# EAGLE design schema (EAGLE 7.3.0)
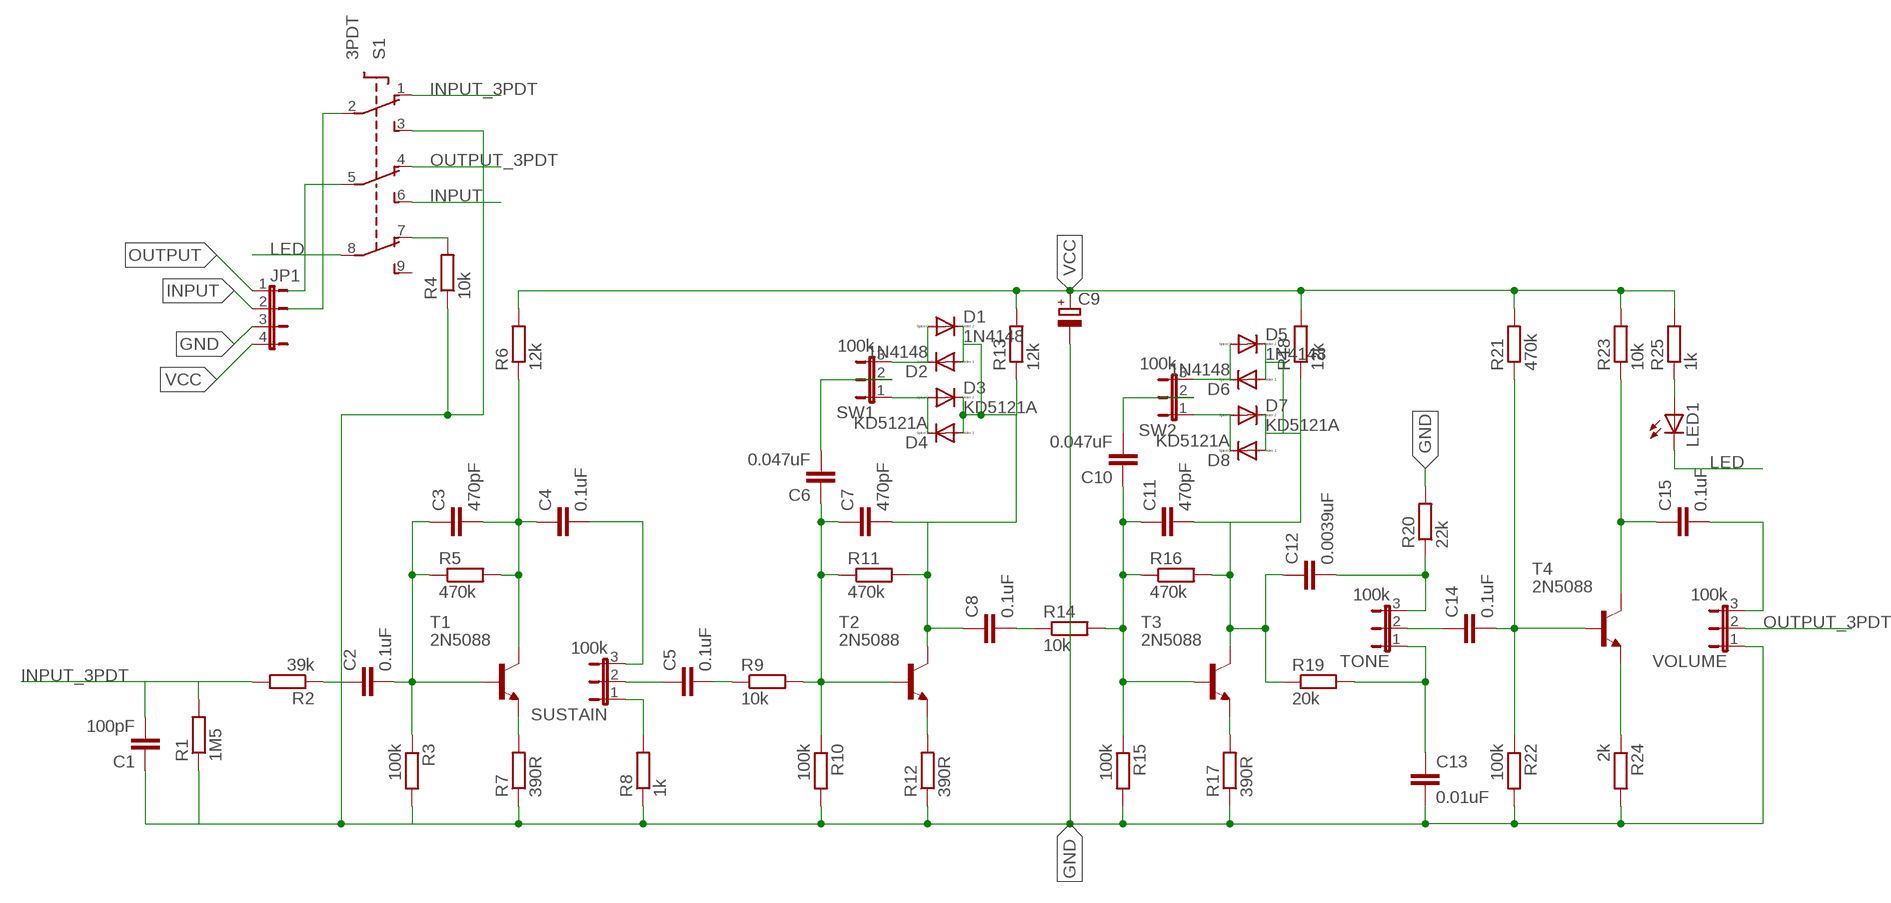
[diagram p0: schematic, sheet 1]

## Parts
C1  100pF  C-EU025-025X050  [C025-025X050]
C2  0.1uF  C-EU075-042X103  [C075-042X103]
C3  470pF  C-EU025-025X050  [C025-025X050]
C4  0.1uF  C-EU075-042X103  [C075-042X103]
C5  0.1uF  C-EU075-042X103  [C075-042X103]
C6  0.047uF  C-EU102-043X133  [C102-043X133]
C7  470pF  C-EU025-025X050  [C025-025X050]
C8  0.1uF  C-EU075-042X103  [C075-042X103]
C9  CPOL-EUE2.5-6  [E2,5-6]
C10  0.047uF  C-EU102-043X133  [C102-043X133]
C11  470pF  C-EU025-025X050  [C025-025X050]
C12  0.0039uF  C-EU050-045X075  [C050-045X075]
C13  0.01uF  C-EU075-042X103  [C075-042X103]
C14  0.1uF  C-EU075-042X103  [C075-042X103]
C15  0.1uF  C-EU075-042X103  [C075-042X103]
D1  1N4148  1N4148DO35-10  [DO35-10]
D2  1N4148  1N4148DO35-10  [DO35-10]
D3  KD5121A  1N4148DO35-10  [DO35-10]
D4  KD5121A  1N4148DO35-10  [DO35-10]
D5  1N4148  1N4148DO35-10  [DO35-10]
D6  1N4148  1N4148DO35-10  [DO35-10]
D7  KD5121A  1N4148DO35-10  [DO35-10]
D8  KD5121A  1N4148DO35-10  [DO35-10]
JP1  JP4E  [JP4]
LED1  LEDB155  [Q62902-B155]
R1  1M5  R-EU_0204/2V  [0204V]
R2  39k  R-EU_0204/2V  [0204V]
R3  100k  R-EU_0204/2V  [0204V]
R4  10k  R-EU_0204/2V  [0204V]
R5  470k  R-EU_0204/2V  [0204V]
R6  12k  R-EU_0204/2V  [0204V]
R7  390R  R-EU_0204/2V  [0204V]
R8  1k  R-EU_0204/2V  [0204V]
R9  10k  R-EU_0204/2V  [0204V]
R10  100k  R-EU_0204/2V  [0204V]
R11  470k  R-EU_0204/2V  [0204V]
R12  390R  R-EU_0204/2V  [0204V]
R13  12k  R-EU_0204/2V  [0204V]
R14  10k  R-EU_0204/2V  [0204V]
R15  100k  R-EU_0204/2V  [0204V]
R16  470k  R-EU_0204/2V  [0204V]
R17  390R  R-EU_0204/2V  [0204V]
R18  12k  R-EU_0204/2V  [0204V]
R19  20k  R-EU_0204/2V  [0204V]
R20  22k  R-EU_0204/2V  [0204V]
R21  470k  R-EU_0204/2V  [0204V]
R22  100k  R-EU_0204/2V  [0204V]
R23  10k  R-EU_0204/2V  [0204V]
R24  2k  R-EU_0204/2V  [0204V]
R25  1k  R-EU_0204/2V  [0204V]
S1  3PDT  [3PDT]
SUSTAIN  100k  JP2E  [JP2]
SW1  100k  JP2E  [JP2]
SW2  100k  JP2E  [JP2]
T1  2N5088  [TO92]
T2  2N5088  [TO92]
T3  2N5088  [TO92]
T4  2N5088  [TO92]
TONE  100k  JP2E  [JP2]
VOLUME  100k  JP2E  [JP2]

## Nets
GND: C1.1 C9.- C13.2 JP1.3 R1.1 R3.2 R4.1 R7.1 R8.1 R10.2 R12.1 R15.2 R17.1 R20.2 R22.2 R24.2 S1.3(S1) VOLUME.1
INPUT: JP1.2 S1.6(S2)
INPUT_3PDT: C1.2 R1.2 R2.2 S1.1(O1)
LED: LED1.K(C) S1.8(P3)
LED_3PDT: R4.2 S1.7(O3)
N$1: C2.2 C3.1 R3.1 R5.1 T1.2(B)
N$2: C2.1 R2.1
N$3: C3.2 C4.1 R5.2 R6.1 T1.1(C)
N$4: R7.2 T1.3(E)
N$5: C6.2 SW1.2
N$6: C14.2 R21.1 R22.1 T4.2(B)
N$7: C11.2 C12.1 D5.C D6.A D7.C D8.A R16.2 R18.1 R19.1 T3.1(C)
N$8: C4.2 SUSTAIN.3
N$9: R8.2 SUSTAIN.1
N$10: C5.1 SUSTAIN.2
N$11: C15.1 R23.1 T4.1(C)
N$12: C5.2 R9.1
N$13: C6.1 C7.1 R9.2 R10.1 R11.1 T2.2(B)
N$14: LED1.A R25.1
N$15: R12.2 T2.3(E)
N$16: R24.1 T4.3(E)
N$17: D7.A D8.C SW2.1
N$18: C10.2 SW2.2
N$19: C15.2 VOLUME.3
N$20: C13.1 R19.2 TONE.1
N$21: C12.2 R20.1 TONE.3
N$22: C14.1 TONE.2
N$23: D1.A D2.C SW1.3
N$24: D5.A D6.C SW2.3
N$25: C8.2 R14.1
N$26: C10.1 C11.1 R14.2 R15.1 R16.1 T3.2(B)
N$27: S1.2(P1)
N$29: C7.2 C8.1 D1.C D2.A D3.C D4.A R11.2 R13.1 T2.1(C)
N$30: S1.5(P2)
N$32: R17.2 T3.3(E)
OUTPUT: JP1.1
OUTPUT_3PDT: S1.4(O2) VOLUME.2
SW1: D3.A D4.C SW1.1
VCC: C9.+ JP1.4 R6.2 R13.2 R18.2 R21.2 R23.2 R25.2
Unconnected: S1.9(S3)

## Library data of the parts
C1-C8 C10-C15 = resistor:C-EU: CAPACITOR, European symbol
C9 = rcl:CPOL-EU: POLARIZED CAPACITOR, European symbol
D1-D8 = diode:1N4148: DIODE high speed (Philips)
JP1 = jumper:JP4E: JUMPER
LED1 = led:LED: LED OSRAM: - CHIPLED LG R971, LG N971, LY N971, LG Q971, LY Q971, LO R971, LY R971 LH N974, LH R974 LS Q976, LO Q976, LY Q976 LO Q996 - Hyper CHIPLED LW Q18S LB Q993, LB Q99A, LB R99A - SideLED LS A670, LO A670, LY A670, LG A670, LP A670 LB A673, LV A673, LT A673, LW A673 LH A674 LY A675 LS A676, LA A676, LO A676, LY A676, LW A676 LS A679, LY A679, LG A679 - Hyper Micro SIDELED® LS Y876, LA Y876, LO Y876, LY Y876 LT Y87S - SmartLED LW L88C, LW L88S LB L89C, LB L89S, LG L890 LS L89K, LO L89K, LY L89K LS L896, LA L896, LO L896, LY L896 - TOPLED LS T670, LO T670, LY T670, LG T670, LP T670 LSG T670, LSP T670, LSY T670, LOP T670, LYG T670 LG T671, LOG T671, LSG T671 LB T673, LV T673, LT T673, LW T673 LH T674 LS T676, LA T676, LO T676, LY T676, LB T676, LH T676, LSB T676, LW T676 LB T67C, LV T67C, LT T67C, LS T67K, LO T67K, LY T67K, LW E67C LS E67B, LA E67B, LO E67B, LY E67B, LB E67C, LV E67C, LT E67C LW T67C LS T679, LY T679, LG T679 LS T770, LO T770, LY T770, LG T770, LP T770 LB T773, LV T773, LT T773, LW T773 LH T774 LS E675, LA E675, LY E675, LS T675 LS T776, LA T776, LO T776, LY T776, LB T776 LHGB T686 LT T68C, LB T68C - Hyper Mini TOPLED® LB M676 - Mini TOPLED Santana® LG M470 LS M47K, LO M47K, LY M47K Source: http://www.osram.convergy.de LUXEON: - LUMILED® LXK2-PW12-R00, LXK2-PW12-S00, LXK2-PW14-U00, LXK2-PW14-V00 LXK2-PM12-R00, LXK2-PM12-S00, LXK2-PM14-U00 LXK2-PE12-Q00, LXK2-PE12-R00, LXK2-PE12-S00, LXK2-PE14-T00, LXK2-PE14-U00 LXK2-PB12-K00, LXK2-PB12-L00, LXK2-PB12-M00, LXK2-PB14-N00, LXK2-PB14-P00, LXK2-PB14-Q00 LXK2-PR12-L00, LXK2-PR12-M00, LXK2-PR14-Q00, LXK2-PR14-R00 LXK2-PD12-Q00, LXK2-PD12-R00, LXK2-PD12-S00 LXK2-PH12-R00, LXK2-PH12-S00 LXK2-PL12-P00, LXK2-PL12-Q00, LXK2-PL12-R00 Source: www.luxeon.com KINGBRIGHT: KA-3528ASYC Source: www.kingbright.com
R1-R25 = resistor:R-EU_: RESISTOR, European symbol
S1 = switch:3PDT: 3PDT 9 pin footswitch SF17020F-0302-21R-L Source: 3PDT.jpg
SUSTAIN SW1 SW2 TONE VOLUME = jumper:JP2E: JUMPER
T1-T4 = transistor-neu-to92:2N5088: NPN TRANSISTOR

## Board
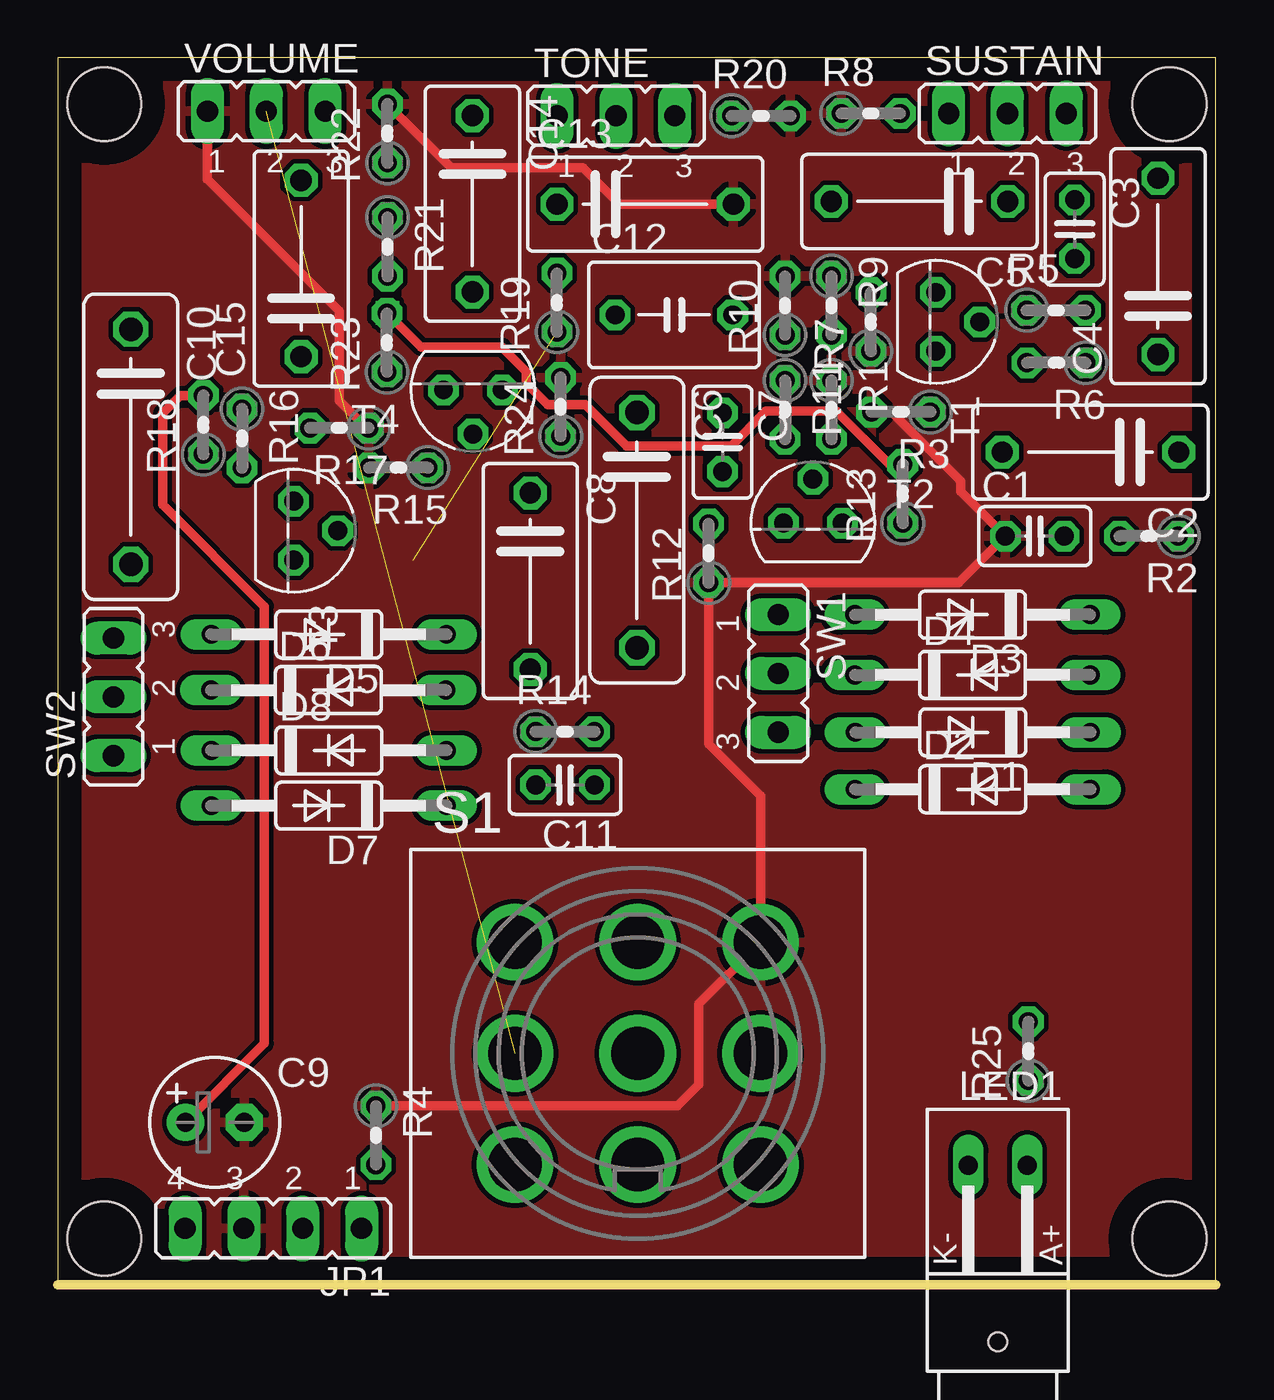
[diagram p1: board, top side]
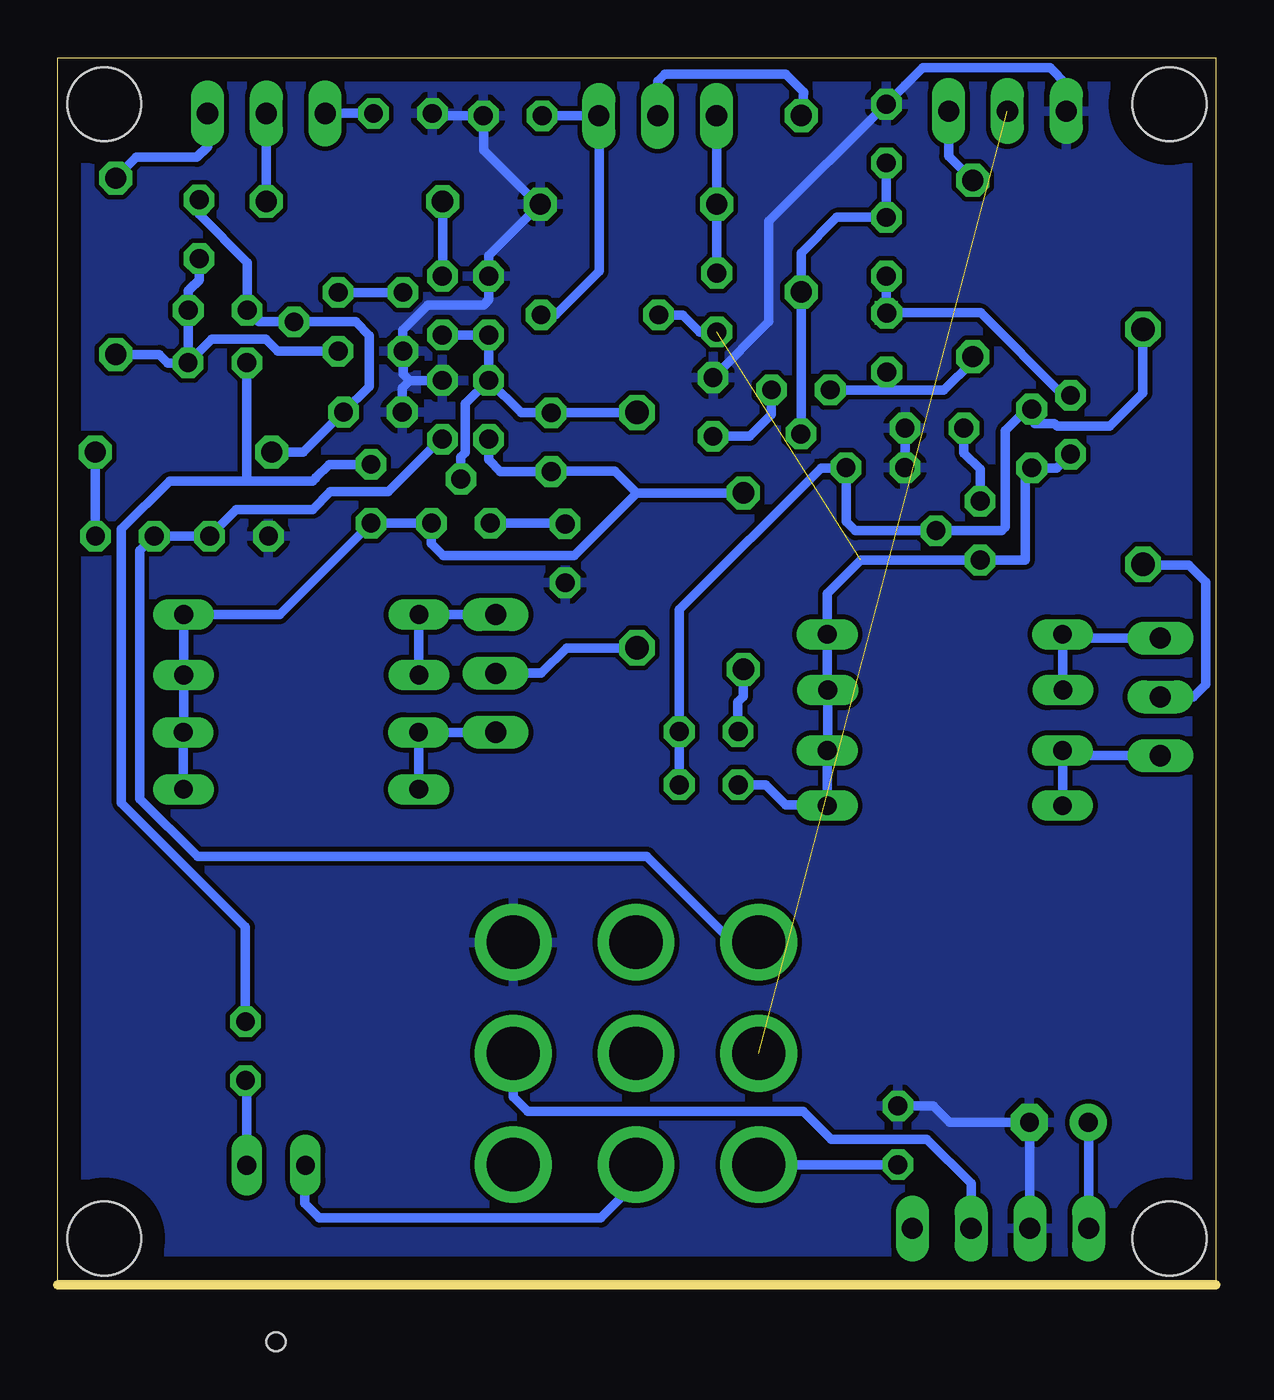
[diagram p2: board, bottom side, seen from below]

Size 50 x 53 mm. Coordinates in mm from the lower left corner, seen from the top.
Outline: 50,0 50,53 0,53 0,0 50,0
Copper layers (1*16): Top 0.035mm / dielectric 1.5mm / Bottom 0.035mm
Design rules "default": minimum track width 10mil, minimum drill 24mil, track to track 8mil, track to pad 8mil, pad to pad 8mil, via to via 8mil, smd to smd 8mil, copper to edge 40mil, drill to drill 8mil, minimum pad ring 10mil, minimum via ring 8mil, stop-mask expansion 4mil, vias tented up to drill 0mil, thermal gap 10mil
Holes 3.2 mm at 2,51 48,51 2,2 48,2

### Footprints (pad centres in the part's own frame; a part is rotated, then mirrored left to right if it is on the bottom)
C025-025X050 = drill 0.813 octagon: 1 -1.27,0; 2 1.27,0
C075-042X103 = drill 0.914 octagon: 1 -3.81,0; 2 3.81,0
C102-043X133 = drill 1.016 octagon: 1 -5.08,0; 2 5.08,0
E2,5-6 = drill 0.813 pad 1.6: + -1.27,0 | drill 0.813 pad 1.6 octagon: - 1.27,0
C050-045X075 = drill 0.813 octagon: 1 -2.54,0; 2 2.54,0
DO35-10 = drill 0.813 long: A 5.08,0; C -5.08,0
JP4 = drill 0.914 long: 1 -3.81,0; 2 -1.27,0; 3 1.27,0; 4 3.81,0
Q62902-B155 = drill 0.813 long: A 7.62,-1.27; K 7.62,1.27 | hole 0.813: 0,0
0204V = drill 0.813 octagon: 1 -1.27,0; 2 1.27,0
3PDT = drill 2.3 pad 3.1: 1 -5.3,4.8; 2 0,4.8; 3 5.3,4.8; 4 -5.3,0; 5 0,0; 6 5.3,0; 7 -5.3,-4.8; 8 0,-4.8; 9 5.3,-4.8
JP2 = drill 0.914 long: 1 -2.54,0; 2 0,0; 3 2.54,0
TO92 = drill 0.813 octagon: 1 1.27,0; 2 0,1.905; 3 -1.27,0

### Placement (x,y rotation side)
C1  42.18,32.34 0 top
C2  44.58,35.97 180 top
C3  43.9,45.6 270 top
C4  47.5,44 90 top
C5  37.2,46.8 180 top
C6  25,32.6 270 top
C7  28.7,36.4 270 top
C8  20.4,30.4 270 top
C9  6.78,7.02 0 top
C10  3.15,36.2 270 top
C11  21.9,21.6 180 top
C12  26.6,41.9 0 top
C13  25.36,46.68 0 top
C14  17.9,46.7 270 top
C15  10.5,43.9 90 top
D1  39.51,23.87 180 top
D2  39.5,21.41 0 top
D3  39.49,28.95 180 top
D4  39.49,26.35 0 top
D5  11.7,28.1 180 top
D6  11.68,25.69 0 top
D7  11.7,20.7 180 top
D8  11.7,23.09 0 top
JP1  9.3,2.44 180 top
LED1  40.58,-2.45 90 top
R1  33.4,37.8 270 top
R2  47.11,32.34 180 top
R3  36.4,37.7 180 top
R4  13.73,6.46 270 top
R5  43.1,42.1 0 top
R6  43.11,39.83 180 top
R7  35.1,41.6 90 top
R8  35.1,50.6 0 top
R9  33.4,42.3 270 top
R10  31.4,42.3 90 top
R11  31.4,37.8 270 top
R12  28.1,31.6 90 top
R13  36.48,34.17 90 top
R14  21.9,23.9 0 top
R15  14.7,35.3 180 top
R16  7.95,36.56 270 top
R17  12.15,37.01 180 top
R18  6.28,37.15 90 top
R19  21.55,42.43 90 top
R20  30.36,50.5 0 top
R21  14.23,44.84 270 top
R22  14.23,49.73 90 top
R23  14.21,40.7 90 top
R24  21.71,37.92 90 top
R25  41.9,10.1 90 top
S1  25.04,10 0 top
SUSTAIN  41,50.6 0 top
SW1  31.1,26.41 270 top
SW2  2.4,25.4 90 top
T1  37.9,41.6 270 top
T2  32.6,32.9 0 top
T3  10.18,32.58 270 top
T4  17.92,38.66 180 top
TONE  24.1,50.5 0 top
VOLUME  9,50.7 0 top

### Tracks (layer width: path | path; a pad name or v marks a point on that pad's centre or on a via)
GND
  Top 0.406: R3.2 36,37.7 38.99,34.71 38.99,34.26 C1.1 38.9,30.33 R12.1 28.1,23.36 30.34,21.12 S1.3 27.67,12.13 27.67,8.66 26.74,7.73 R4.1 | C13.2 24.24,46.68 22.67,48.25 16.98,48.25 R22.2 | R17.1 13.33,37.01 12.14,38.2 12.14,42.05 6.44,47.75 6.44,50.68 VOLUME.1
  Bottom 0.406: R1.1 34.8,39.07 | 34.8,39.07 35.08,39.35 35.08,40.31 R7.1 35.1,41.23 35.11,41.24 34.02,42.33 31.62,42.33 31.4,42.55 R10.2 31.4,44.45 C13.2 29.29,46.68 31.62,49.01 R20.2 33.73,50.5 R8.1 | R3.2 35.13,38.74 34.8,39.07 | R17.1 R15.2 | R24.2 19.3,41.6 19.3,45.94 R22.2 12.66,52.57 7.16,52.57 6.46,51.87 VOLUME.1 | JP1.3 8.03,7 C9.- 11.5,7.02 12.21,7.73 R4.1
  pour Bottom: 0,53 0,0 50,0 50,53
  pour Top: 0,53 0,0 50,0 50,53
INPUT
  Bottom 0.406: JP1.2 10.57,4.38 12.48,6.29 16.61,6.29 17.81,7.49 29.71,7.49 30.34,8.12 S1.6
INPUT_3PDT
  Bottom 0.406: R1.2 33.46,36.53 35.73,34.26 38.24,34.26 39,33.5 42.29,33.5 C1.2 R2.2 46.46,31.72 46.46,21 43.97,18.51 24.57,18.51 20.86,14.8 S1.1
LED
  Bottom 0.406: S1.8 25.04,4.4 26.55,2.89 38.72,2.89 39.35,3.52 39.35,5.13 LED1.K
LED_3PDT
  Bottom 0.406: R4.2 S1.7
N$1
  Bottom 0.406: C3.1 43.9,46.24 41.82,44.16 R5.1 41.33,41.6 T1.2 37.15,41.6 36.56,41.01 36.56,38.81 R3.1 39.4,35.97 C2.2
N$2
  Bottom 0.406: C2.1 R2.1
N$3
  Bottom 0.406: C3.2 43.9,43.4 44.3,43 44.31,43 44.37,42.94 R5.2 R6.1 | T1.1 40.5,40.33 41.03,40.86 43.35,40.86 R6.1 | C4.1 45.62,40.19 45.25,39.82 R6.1
N$4
  Bottom 0.406: R7.2 T1.3
N$5
  Bottom 0.406: C6.2 28.03,27.52 29.13,26.42 SW1.2
N$6
  Bottom 0.406: T4.2 17.9,36.77 C14.2 17.9,44.57 16.36,46.11 R21.1 R22.1
N$7  (1 unrouted)
  Bottom 0.406: C11.2 19.43,21.6 18.57,20.74 16.82,20.74 D7.C D8.A 16.76,23.11 D6.A 16.78,25.71 D5.C 16.78,29.87 15.34,31.31 T3.1 8.23,31.31 8.23,35.01 R16.2 6.87,35.29 R18.1 | R19.1 22.29,41.16 23.02,41.89 C12.1
N$8
  Bottom 0.406: SUSTAIN.3 43.54,49.16 44,48.7 46.61,48.7 C4.2
N$9
  Bottom 0.406: SUSTAIN.1 R8.2
N$10
  Bottom 0.406: SUSTAIN.2 C5.1
N$11
  Bottom 0.406: R23.1 14.21,38.91 14.46,38.66 15.39,38.66 | 15.39,38.66 T4.1 | C15.1 10.5,39.89 11.74,38.65 15.38,38.65 15.39,38.66
N$12
  Bottom 0.406: C5.2 R9.1
N$13
  Bottom 0.406: R9.2 R10.1 R11.1 | C6.1 C7.1 30,37.67 R11.1 | T2.2 32.6,35.76 32.41,35.95 32.41,38.06 R11.1
N$14
  Bottom 0.406: LED1.A 41.85,8.78 R25.1
N$15
  Bottom 0.406: T2.3 28.13,32.9 R12.2
N$16
  Bottom 0.406: T4.3 19.19,37.59 20.12,36.66 R24.1
N$17
  Bottom 0.406: SW2.1 6.39,22.86 D8.C D7.A
N$18
  Bottom 0.406: SW2.2 0.98,25.4 0.44,25.94 0.44,30.36 1.17,31.09 3.12,31.09 C10.2
N$19
  Bottom 0.406: VOLUME.3 11.54,48.75 C15.2
N$20
  Bottom 0.406: TONE.1 C13.1 R19.2
N$21
  Bottom 0.406: R20.1 TONE.3 26.63,43.78 28.51,41.9 C12.2
N$22
  Bottom 0.406: C14.1 17.8,51.52 18.58,52.3 23.79,52.3 24.09,52 TONE.2
N$23
  Bottom 0.406: D2.C D1.A SW1.3
N$24
  Bottom 0.406: SW2.3 6.46,27.94 D5.A 6.62,25.71 D6.C
N$25
  Bottom 0.406: C8.2 20.4,25.41 20.64,25.17 R14.1
N$26
  Bottom 0.406: C11.1 R14.2 23.17,29.17 17.05,35.29 R15.1 15.97,32.98 15.57,32.58 T3.2 9.24,32.58 9.09,32.73 9.09,36.9 8.16,37.83 R16.1 7.83,37.21 6.97,37.21 6.86,37.1 4.58,37.1 3.15,38.53 C10.1
N$29
  Bottom 0.406: D2.A D1.C 44.57,23.89 D4.A D3.C 40.43,28.95 R13.1 T2.1 33.87,32.02 33.36,31.51 27.71,31.51 25.01,34.21 | C8.1 25.01,34.21 | 25.01,34.21 25.95,35.15 28.68,35.15 C7.2 30.89,35.13 31.4,35.64 R11.2
N$32
  Bottom 0.406: R17.2 10.88,35.94 10.18,35.24 T3.3
OUTPUT_3PDT  (1 unrouted)
SW1
  Bottom 0.406: D4.C D3.A SW1.1
VCC  (via drill 0.6)
  Top 0.406: v14.23,41.99 14.23,41.97 15.69,40.51 19.17,40.51 20.23,39.45 20.23,38.95 21.16,38.02 22.78,38.02 24.56,36.24 29.07,36.24 30.57,37.74 33.61,37.74 35.89,35.46 36.46,35.46 R13.2 | C9.+ 8.92,10.43 8.92,29.31 4.52,33.71 4.52,37.65 5.29,38.42 R18.2
  Bottom 0.406: R13.2 38.29,35.44 38.86,34.87 38.86,34.86 39,34.72 42,34.72 | R6.2 41.85,34.87 42,34.72 | R21.2 v14.23,41.99 R23.2 14.19,41.99 10.16,41.99 6.59,38.42 R18.2 | JP1.4 5.49,7 C9.+ | R25.2 41.9,15.46 47.26,20.82 47.26,32.64 45.18,34.72 42,34.72